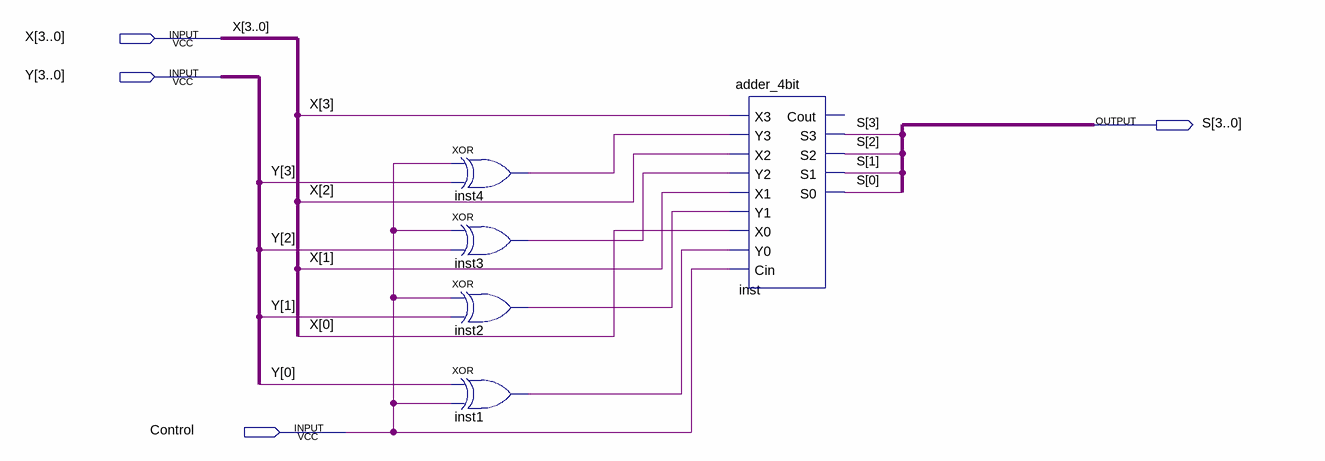
[diagram p0: schematic sheet]
// Quartus schematic add_sub.bdf as structural Verilog: 5 symbols, 4 pins
module add_sub (
  input  [3:0] X,
  input  [3:0] Y,
  input  Control,
  output [3:0] S
);

  wire inst1_out, inst2_out, inst3_out, inst4_out;

  xor inst4 (inst4_out, Control, Y[3]);
  xor inst3 (inst3_out, Control, Y[2]);
  xor inst2 (inst2_out, Control, Y[1]);
  xor inst1 (inst1_out, Y[0], Control);
  adder_4bit inst (
    .X3(X[3]), .Y3(inst4_out), .X2(X[2]), .Y2(inst3_out), .X1(X[1]), .Y1(inst2_out), .X0(X[0]),
    .Y0(inst1_out), .Cin(Control), .S3(S[3]), .S2(S[2]), .S1(S[1]), .S0(S[0]));  // open: Cout
endmodule
